# EAGLE design Protecto2 (EAGLE 9.1.3)
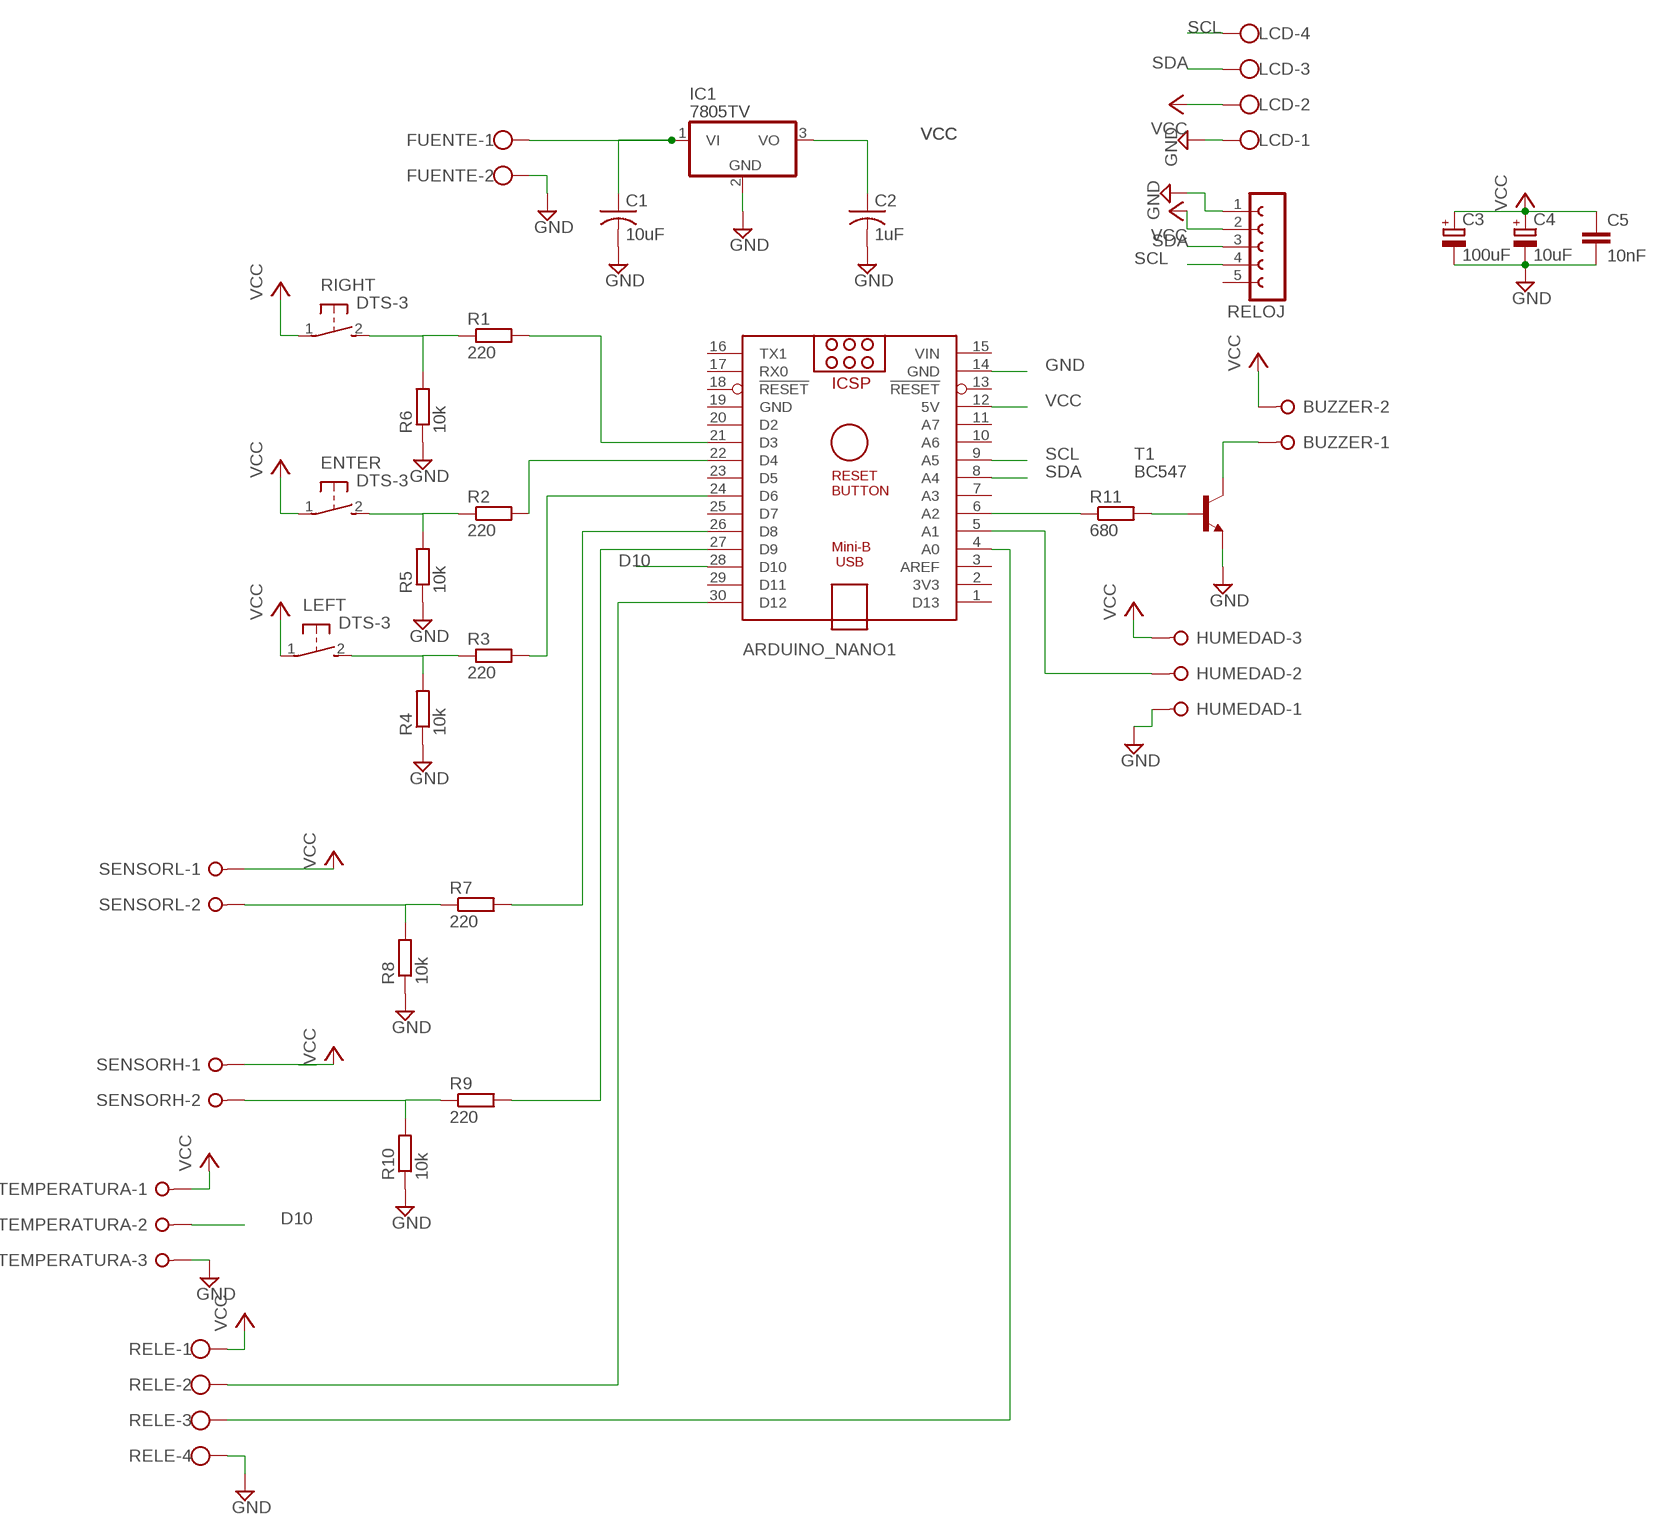
[diagram p0: schematic, sheet 1]

## Parts
ARDUINO_NANO1  ARDUINO_NANO  [ARDUINO_NANO]
BUZZER  W237-02P  [W237-132]
C1  10uF  C-US025-040X050  [C025-040X050]
C2  1uF  C-US025-040X050  [C025-040X050]
C3  100uF  CPOL-EUE2.5-7  [E2,5-7]
C4  10uF  CPOL-EUE2-5  [E2-5]
C5  10nF  C-EU025-030X050  [C025-030X050]
ENTER  DTS-3  [DTS-3]
FUENTE  W237-102  [W237-102]
HUMEDAD  W237-3E  [W237-3E]
IC1  7805TV  [TO220V]
LCD  W237-4  [W237-4]
LEFT  DTS-3  [DTS-3]
R1  220  R-EU_0207/10  [0207/10]
R2  220  R-EU_0207/10  [0207/10]
R3  220  R-EU_0207/10  [0207/10]
R4  10k  R-EU_0207/10  [0207/10]
R5  10k  R-EU_0207/10  [0207/10]
R6  10k  R-EU_0207/10  [0207/10]
R7  220  R-EU_0207/10  [0207/10]
R8  10k  R-EU_0207/10  [0207/10]
R9  220  R-EU_0207/10  [0207/10]
R10  10k  R-EU_0207/10  [0207/10]
R11  680  R-EU_0207/10  [0207/10]
RELE  W237-4  [W237-4]
RELOJ  FE05-1  [FE05-1]
RIGHT  DTS-3  [DTS-3]
SENSORH  W237-02P  [W237-132]
SENSORL  W237-02P  [W237-132]
T1  BC547  [TO92]
TEMPERATURA  W237-3E  [W237-3E]

## Nets
D10: ARDUINO_NANO1.28(D10) TEMPERATURA.2
GND: ARDUINO_NANO1.14(GND) C1.2 C2.2 C3.- C4.- C5.2 FUENTE.2 HUMEDAD.1 IC1.2(GND) LCD.1 R4.1 R5.1 R6.1 R8.1 R10.1 RELE.4 RELOJ.1 T1.1(E) TEMPERATURA.3
N$1: R1.1 R6.2 RIGHT.2
N$2: ENTER.2 R2.1 R5.2
N$3: LEFT.2 R3.1 R4.2
N$4: ARDUINO_NANO1.21(D3) R1.2
N$5: ARDUINO_NANO1.22(D4) R2.2
N$6: ARDUINO_NANO1.24(D6) R3.2
N$7: R7.1 R8.2 SENSORL.2
N$8: R9.1 R10.2 SENSORH.2
N$9: ARDUINO_NANO1.26(D8) R7.2
N$10: ARDUINO_NANO1.27(D9) R9.2
N$11: ARDUINO_NANO1.4(A0) RELE.3
N$12: ARDUINO_NANO1.30(D12) RELE.2
N$13: ARDUINO_NANO1.5(A1) HUMEDAD.2
N$14: BUZZER.1 T1.3(C)
N$15: R11.2 T1.2(B)
N$16: ARDUINO_NANO1.6(A2) R11.1
N$17: C1.1 FUENTE.1 IC1.1(VI)
SCL: ARDUINO_NANO1.9(A5) LCD.4 RELOJ.4
SDA: ARDUINO_NANO1.8(A4) LCD.3 RELOJ.3
VCC: ARDUINO_NANO1.12(5V) BUZZER.2 C2.1 C3.+ C4.+ C5.1 ENTER.1 HUMEDAD.3 IC1.3(VO) LCD.2 LEFT.1 RELE.1 RELOJ.2 RIGHT.1 SENSORH.1 SENSORL.1 TEMPERATURA.1
Unconnected: ARDUINO_NANO1.1(D13) ARDUINO_NANO1.2(3V3) ARDUINO_NANO1.3(AREF) ARDUINO_NANO1.7(A3) ARDUINO_NANO1.10(A6) ARDUINO_NANO1.11(A7) ARDUINO_NANO1.13(!RESET) ARDUINO_NANO1.16(TX1) ARDUINO_NANO1.17(RX0) ARDUINO_NANO1.18(!RESET) ARDUINO_NANO1.20(D2) ARDUINO_NANO1.23(D5) ARDUINO_NANO1.25(D7) ARDUINO_NANO1.29(D11) RELOJ.5

## Power pins joined to a net without a drawn wire
GND: ARDUINO_NANO1.19(GND)
VIN: ARDUINO_NANO1.15(VIN)

## Library data of the parts
ARDUINO_NANO1 = ArduinoNanoV30:ARDUINO_NANO: Arduino Nano V3.0 Overview: The Arduino Nano is a small, complete, and breadboard-friendly board based on the ATmega328 (Arduino Nano 3.x) or ATmega168 (Arduino Nano 2.x). It has more or less the same functionality of the Arduino Duemilanove, but in a different package. It lacks only a DC power jack, and works with a Mini-B USB cable instead of a standard one. The Nano was designed and is being produced by Gravitech. Specifications: Microcontroller Atmel ATmega168 or ATmega328 Operating Voltage (logic level) 5 V Input Voltage (recommended) 7-12 V Input Voltage (limits) 6-20 V Digital I/O Pins 14 (of which 6 provide PWM output) Analog Input Pins 8 DC Current per I/O Pin 40 mA Flash Memory 16 KB (ATmega168) or 32 KB (ATmega328) of which 2 KB used by bootloader SRAM 1 KB (ATmega168) or 2 KB (ATmega328) EEPROM 512 bytes (ATmega168) or 1 KB (ATmega328) Clock Speed 16 MHz Dimensions 0.73" x 1.70" Length 45 mm Width 18 mm Weigth 5 g Power: The Arduino Nano can be powered via the Mini-B USB connection, 6-20V unregulated external power supply (pin 30), or 5V regulated external power supply (pin 27). The power source is automatically selected to the highest voltage source. Memory: The ATmega168 has 16 KB of flash memory for storing code (of which 2 KB is used for the bootloader); the ATmega328 has 32 KB, (also with 2 KB used for the bootloader). The ATmega168 has 1 KB of SRAM and 512 bytes of EEPROM (which can be read and written with the EEPROM library); the ATmega328 has 2 KB of SRAM and 1 KB of EEPROM. Input and Output: Each of the 14 digital pins on the Nano can be used as an input or output, using pinMode(), digitalWrite(), and digitalRead() functions. They operate at 5 volts. Each pin can provide or receive a maximum of 40 mA and has an internal pull-up resistor (disconnected by default) of 20-50 kOhms. In addition, some pins have specialized functions. Visit Arduino - ArduinoBoardNano <https://www.arduino.cc/en/Main/ArduinoBoardNano>
BUZZER SENSORH SENSORL = con-wago-508:W237-02P: WAGO SREW CLAMP; OC_FARNELL: unknown; OC_NEWARK: unknown
C1 C2 = rcl:C-US: CAPACITOR, American symbol; SPICEPREFIX: C
C3 C4 = rcl:CPOL-EU: POLARIZED CAPACITOR, European symbol; SPICEPREFIX: C
C5 = rcl:C-EU: CAPACITOR, European symbol; SPICEPREFIX: C
ENTER LEFT RIGHT = switch-tact:DTS-3
FUENTE = con-wago-500:W237-102: WAGO SCREW CLAMP; MPN: 237-102; OC_FARNELL: unknown; OC_NEWARK: 70K9898
HUMEDAD TEMPERATURA = con-wago-508:W237-3E: WAGO SREW CLAMP; OC_FARNELL: unknown; OC_NEWARK: unknown
IC1 = linear:78*: Positive VOLTAGE REGULATOR Source: http://cache.national.com/ds/LM/LM78L05.pdf http://www.fairchildsemi.com/ds/LM/LM7805.pdf
LCD RELE = con-wago-500:W237-4: WAGO SCREW CLAMP; OC_FARNELL: unknown; OC_NEWARK: unknown
R1-R11 = rcl:R-EU_: RESISTOR, European symbol; SPICEPREFIX: R
RELOJ = con-lsta:FE05-1: FEMALE HEADER; OC_FARNELL: unknown; OC_NEWARK: unknown
T1 = transistor:BC547: NPN TRANSISTOR

## Board
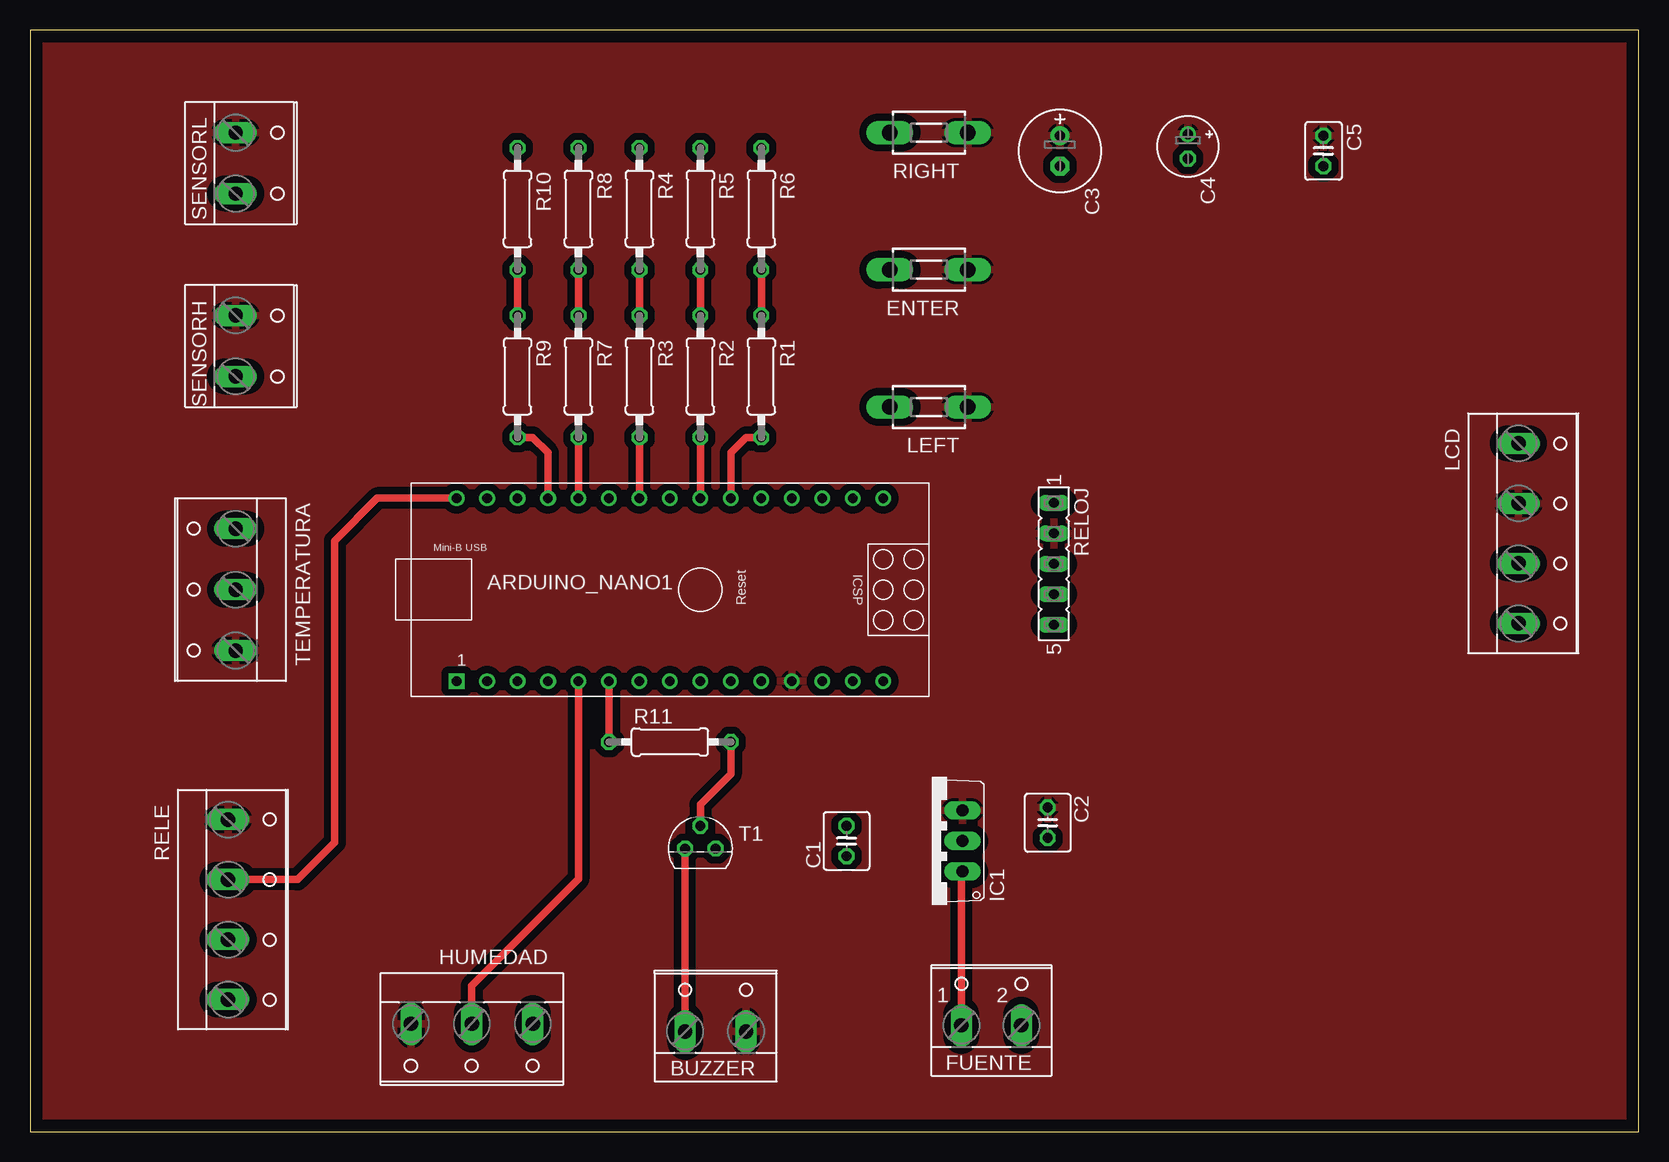
[diagram p1: board, top side]
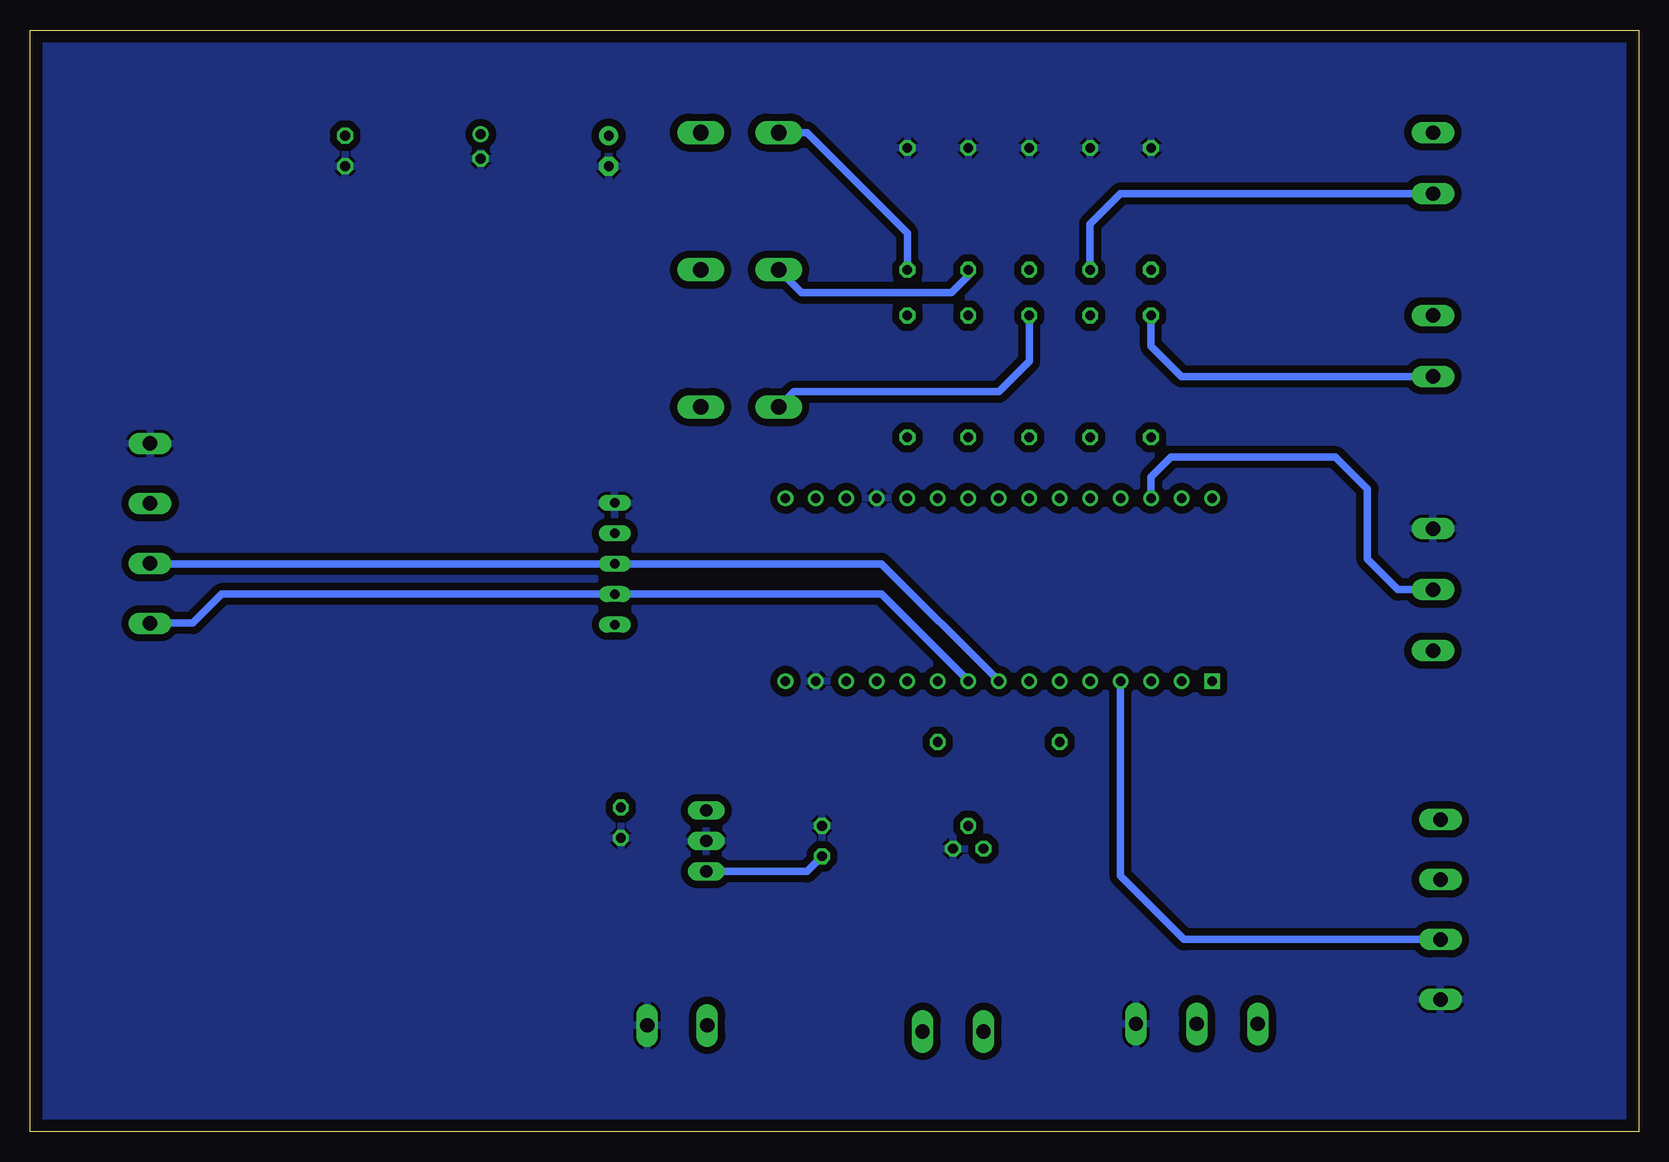
[diagram p2: board, bottom side, seen from below]

Size 134.09 x 91.87 mm. Coordinates in mm from the lower left corner, seen from the top.
Outline: 0,0 134.09,0 134.09,91.87 0,91.87 0,0
Copper layers (1*16): Top 0.035mm / dielectric 1.5mm / Bottom 0.035mm
Design rules "default": minimum track width 6mil, minimum drill 0.35mm, track to track 6mil, track to pad 6mil, pad to pad 6mil, via to via 6mil, smd to smd 6mil, copper to edge 40mil, drill to drill 6mil, minimum pad ring 10mil, minimum via ring 8mil, stop-mask expansion 4mil, vias tented up to drill 0mil, thermal gap 10mil

### Footprints (pad centres in the part's own frame; a part is rotated, then mirrored left to right if it is on the bottom)
ARDUINO_NANO = drill 0.8 square: 1 -20.32,-7.62 | drill 0.8: 2 -17.78,-7.62; 3 -15.24,-7.62; 4 -12.7,-7.62; 5 -10.16,-7.62; 6 -7.62,-7.62; 7 -5.08,-7.62; 8 -2.54,-7.62; 9 0,-7.62; 10 2.54,-7.62; 11 5.08,-7.62; 12 7.62,-7.62; 13 10.16,-7.62; 14 12.7,-7.62; 15 15.24,-7.62; 16 15.24,7.62; 17 12.7,7.62; 18 10.16,7.62; 19 7.62,7.62; 20 5.08,7.62; 21 2.54,7.62; 22 0,7.62; 23 -2.54,7.62; 24 -5.08,7.62; 25 -7.62,7.62; 26 -10.16,7.62; 27 -12.7,7.62; 28 -15.24,7.62; 29 -17.78,7.62; 30 -20.32,7.62
W237-132 = drill 1.194 long: 1 -2.54,-0.635; 2 2.54,-0.635
C025-040X050 = drill 0.813 octagon: 1 -1.27,0; 2 1.27,0
E2,5-7 = drill 0.813 pad 1.6: + -1.27,0 | drill 0.813 pad 1.6 octagon: - 1.27,0
E2-5 = drill 0.813 pad 1.27: + -1.016,0 | drill 0.813 pad 1.27 octagon: - 1.016,0
C025-030X050 = drill 0.813 octagon: 1 -1.27,0; 2 1.27,0
DTS-3 = drill 1.3 long: 1 -3.25,0; 2 3.25,0
W237-102 = drill 1.194 long: 1 -2.5,-1.27; 2 2.5,-1.27
W237-3E = drill 1.194 long: 1 -5.08,-0.635; 2 0,-0.635; 3 5.08,-0.635
TO220V = drill 1.016 long: 1 -2.54,-2.54; 2 0,-2.54; 3 2.54,-2.54
W237-4 = drill 1.194 long: 1 -7.5,-1.27; 2 -2.5,-1.27; 3 2.5,-1.27; 4 7.5,-1.27
0207/10 = drill 0.813 octagon: 1 -5.08,0; 2 5.08,0
FE05-1 = drill 0.813 long: 1 -5.08,0; 2 -2.54,0; 3 0,0; 4 2.54,0; 5 5.08,0
TO92 = drill 0.813 octagon: 1 1.27,0; 2 0,1.905; 3 -1.27,0

### Placement (x,y rotation side)
ARDUINO_NANO1  55.88,45.21 0 top
BUZZER  57.15,9.02 0 top
C1  68.07,24.26 90 top
C2  84.84,25.78 270 top
C3  85.85,81.79 270 top
C4  96.52,82.17 270 top
C5  107.82,81.79 270 top
ENTER  74.93,71.88 180 top
FUENTE  80.14,10.16 0 top
HUMEDAD  36.83,8.38 180 top
IC1  75.18,24.26 90 top
LCD  125.35,49.91 270 top
LEFT  74.93,60.45 180 top
R1  60.96,62.99 270 top
R2  55.88,62.99 270 top
R3  50.8,62.99 270 top
R4  50.8,76.96 270 top
R5  55.88,76.96 270 top
R6  60.96,76.96 270 top
R7  45.72,62.99 270 top
R8  45.72,76.96 270 top
R9  40.64,62.99 270 top
R10  40.64,76.96 270 top
R11  [0207/10]  53.34,32.51 0 top
RELE  17.78,18.54 270 top
RELOJ  85.34,47.37 270 top
RIGHT  74.93,83.31 180 top
SENSORH  17.78,65.53 270 top
SENSORL  17.78,80.77 270 top
T1  55.88,23.62 0 top
TEMPERATURA  16.51,45.21 90 top

### Tracks (layer width: path | path; a pad name or v marks a point on that pad's centre or on a via)
D10
  Bottom 0.61: TEMPERATURA.2 20.07,45.21 22.61,47.75 22.61,53.59 25.27,56.26 38.99,56.26 40.64,54.61 ARDUINO_NANO1.28
GND
  pour Bottom (isolate 0.61): 0.38,91.57 0.38,0.38 0.25,0.25 133.86,0.25 134.11,0 134.11,91.57
N$1
  Top 0.61: R1.1 R6.2
  Bottom 0.61: R6.2 60.96,74.93 69.34,83.31 RIGHT.2
N$2
  Top 0.61: R2.1 R5.2
  Bottom 0.61: ENTER.2 69.78,69.98 57.28,69.98 55.88,71.37 R5.2
N$3
  Top 0.61: R3.1 R4.2
  Bottom 0.61: LEFT.2 70.41,61.72 53.34,61.72 50.8,64.26 R3.1
N$4
  Top 0.61: ARDUINO_NANO1.21 58.42,56.64 59.69,57.91 R1.2
N$5
  Top 0.61: ARDUINO_NANO1.22 R2.2
N$6
  Top 0.61: ARDUINO_NANO1.24 R3.2
N$7
  Top 0.61: R7.1 R8.2
  Bottom 0.61: SENSORL.2 43.18,78.23 45.72,75.69 R8.2
N$8
  Top 0.61: R9.1 R10.2
  Bottom 0.61: SENSORH.2 38.1,62.99 40.64,65.53 R9.1
N$9
  Top 0.61: ARDUINO_NANO1.26 R7.2
N$10
  Top 0.61: ARDUINO_NANO1.27 43.18,56.64 41.91,57.91 R9.2
N$11
  Bottom 0.61: RELE.3 37.89,16.04 43.18,21.34 ARDUINO_NANO1.4
N$12
  Top 0.61: ARDUINO_NANO1.30 28.96,52.83 25.4,49.28 25.4,24.13 22.31,21.04 RELE.2
N$13
  Top 0.61: ARDUINO_NANO1.5 45.72,21.08 36.83,12.19 HUMEDAD.2
N$14
  Top 0.61: BUZZER.1 T1.3
N$15
  Top 0.61: R11.2 58.42,29.84 55.88,27.3 T1.2
N$16
  Top 0.61: ARDUINO_NANO1.6 R11.1
N$17
  Top 0.61: FUENTE.1 77.64,21.63 IC1.1
  Bottom 0.61: C1.1 69.34,21.72 IC1.1
SCL
  Bottom 0.61: ARDUINO_NANO1.9 63.12,44.83 RELOJ.4 118.11,44.83 120.52,42.42 LCD.4
SDA
  Bottom 0.61: ARDUINO_NANO1.8 63.12,47.37 RELOJ.3 124.04,47.37 LCD.3
VCC
  pour Top (isolate 0.61): 0.25,91.69 133.99,91.69 133.99,0.13 0.25,0.13